# EAGLE design LoRaWAN_FW_RevB (EAGLE 7.2.0)
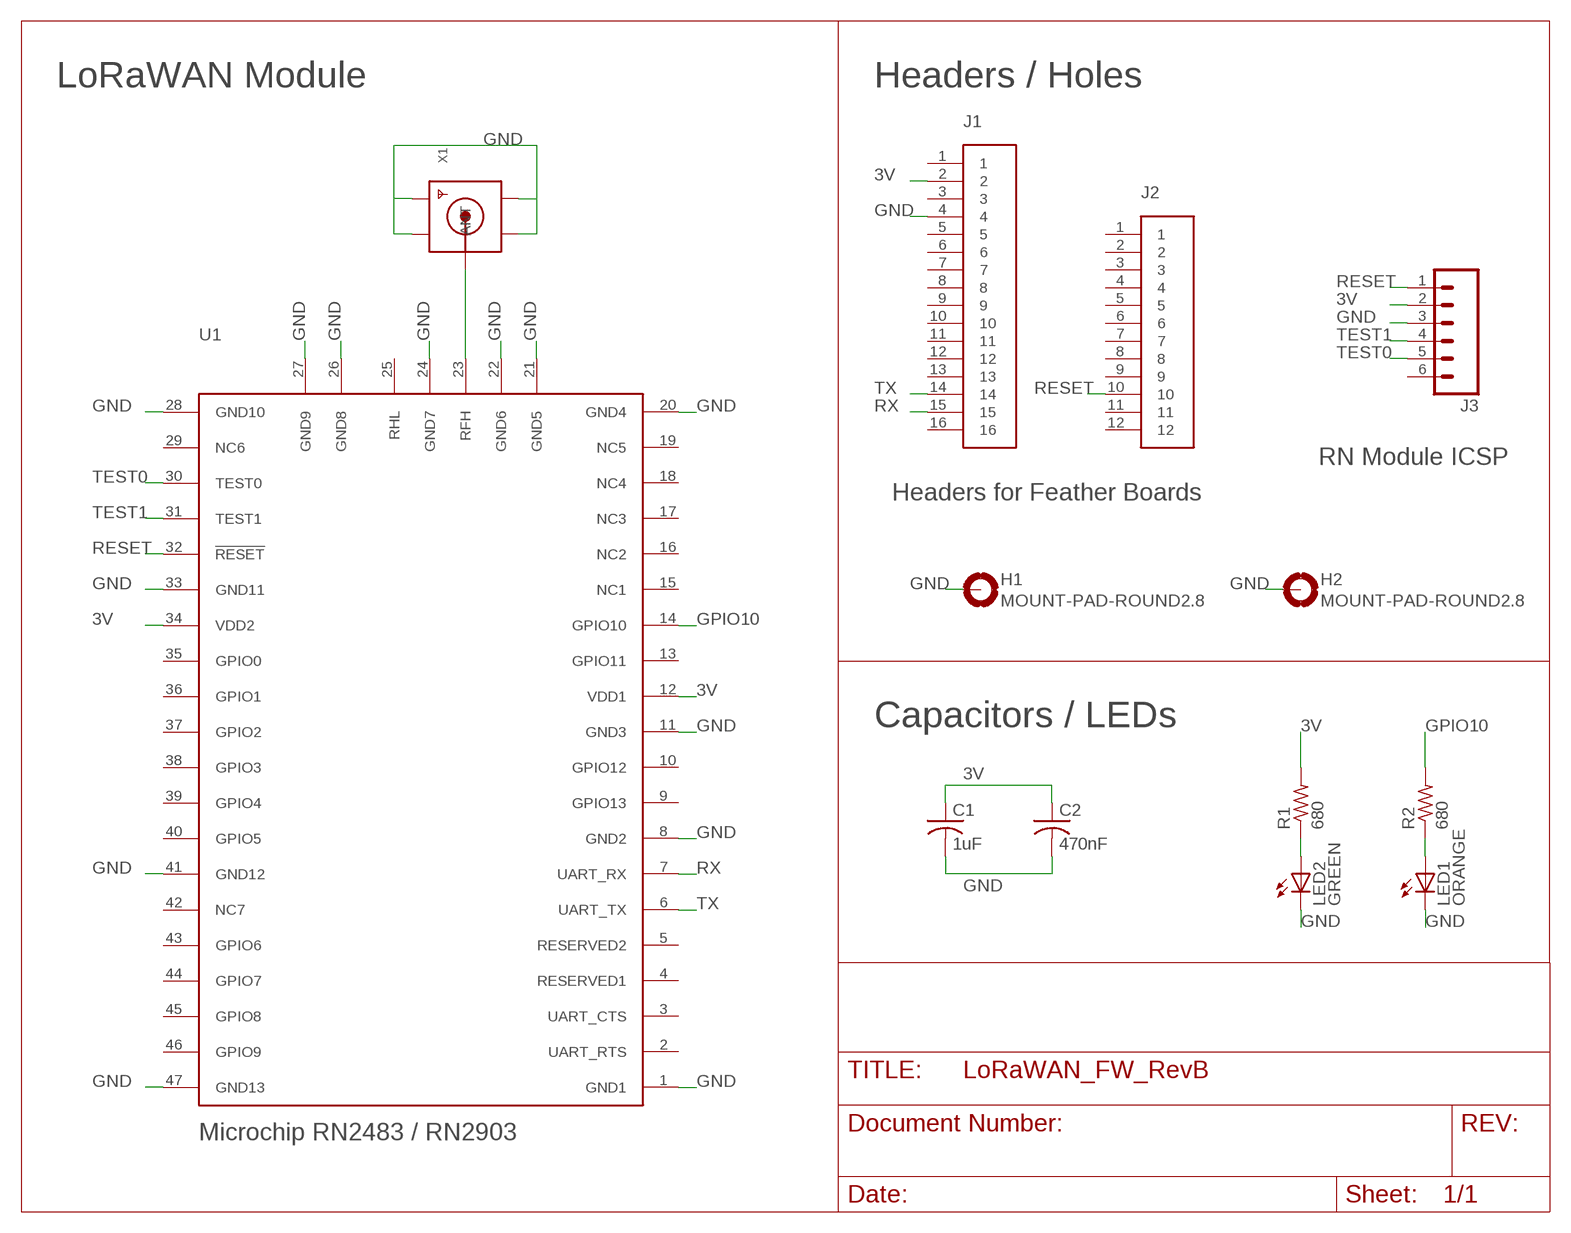
[diagram p0: schematic, sheet 1]

## Parts
C1  1uF  C-USC0603  [C0603]
C2  470nF  C-USC0603  [C0603]
H1  MOUNT-PAD-ROUND2.8  [2,8-PAD]
H2  MOUNT-PAD-ROUND2.8  [2,8-PAD]
J1  1X16_SMD_HEADER  [1X16_SMD_HEADER]
J2  1X12_SMD_HEADER  [1X12_SMD_HEADER]
J3  M06SILK_FEMALE_PTH  [1X06]
LED1  ORANGE  LEDCHIPLED_0805  [CHIPLED_0805]
LED2  GREEN  LEDCHIPLED_0805  [CHIPLED_0805]
R1  680  R-US_R0603  [R0603]
R2  680  R-US_R0603  [R0603]
U1  RN2483/RN2903  [RN2483/RN2903]
X1  SMACONNECTOR_EDGE  [SMA_EDGELAUNCH]

## Nets
3V: C1.1 C2.1 J1.2 J3.2 R1.2 U1.12(VDD1) U1.34(VDD2)
GND: C1.2 C2.2 H1.B2,8(MOUNT) H2.B2,8(MOUNT) J1.4 J3.3 LED1.C LED2.C U1.1(GND1) U1.8(GND2) U1.11(GND3) U1.20(GND4) U1.21(GND5) U1.22(GND6) U1.24(GND7) U1.26(GND8) U1.27(GND9) U1.28(GND10) U1.33(GND11) U1.41(GND12) U1.47(GND13) X1.GND@1(GND4) X1.GND@2(GND3) X1.GND@3(GND2) X1.GND@4(GND1)
GPIO10: R2.2 U1.14(GPIO10)
N$2: LED1.A R2.1
N$3: U1.23(RFH) X1.P(ANT)
N$9: LED2.A R1.1
RESET: J2.10 J3.1 U1.32(!RESET)
RX: J1.15 U1.7(UART_RX)
TEST0: J3.5 U1.30(TEST0)
TEST1: J3.4 U1.31(TEST1)
TX: J1.14 U1.6(UART_TX)
Unconnected: J1.1 J1.3 J1.5 J1.6 J1.7 J1.8 J1.9 J1.10 J1.11 J1.12 J1.13 J1.16 J2.1 J2.2 J2.3 J2.4 J2.5 J2.6 J2.7 J2.8 J2.9 J2.11 J2.12 J3.6 U1.2(UART_RTS) U1.3(UART_CTS) U1.4(RESERVED1) U1.5(RESERVED2) U1.9(GPIO13) U1.10(GPIO12) U1.13(GPIO11) U1.15(NC1) U1.16(NC2) U1.17(NC3) U1.18(NC4) U1.19(NC5) U1.25(RHL) U1.29(NC6) U1.35(GPIO0) U1.36(GPIO1) U1.37(GPIO2) U1.38(GPIO3) U1.39(GPIO4) U1.40(GPIO5) U1.42(NC7) U1.43(GPIO6) U1.44(GPIO7) U1.45(GPIO8) U1.46(GPIO9)

## Notes on the sheet
- LoRaWAN Module | Headers / Holes
- RN Module ICSP
- Headers for Feather Boards
- Capacitors / LEDs
- Microchip RN2483 / RN2903

## Library data of the parts
C1 C2 = adafruit:C-US: CAPACITOR, American symbol
H1 H2 = holes:MOUNT-PAD-ROUND: MOUNTING PAD, round
J1 = SyncChannelCustom:1X16_SMD_HEADER: 1x16 pin 0.1" Header SMD< Digikey Part Number: - Male: S5647-ND
J2 = SyncChannelCustom:1X12_SMD_HEADER: 1x12 pin 0.1" Header SMD Digikey Part Number: - Male: S5643-ND
J3 = SparkFun-ConnectorsNEW:M06: Header 6 Standard 6-pin 0.1" header. Use with straight break away headers (SKU : PRT-00116), right angle break away headers (PRT-00553), swiss pins (PRT-00743), machine pins (PRT-00117), and female headers (PRT-00115). Molex polarized connector foot print use with SKU : PRT-08094 with associated crimp pins and housings. NOTES ON THE VARIANTS LOCK and LOCK_LONGPADS... This footprint was designed to help hold the alignment of a through-hole component (i.e. 6-pin header) while soldering it into place. You may notice that each hole has been shifted either up or down by 0.005 of an inch from it's more standard position (which is a perfectly straight line). This slight alteration caused the pins (the squares in the middle) to touch the edges of the holes. Because they are alternating, it causes a "brace" to hold the component in place. 0.005 has proven to be the perfect amount of "off-center" position when using our standard breakaway headers. Although looks a little odd when you look at the bare footprint, once you have a header in there, the alteration is very hard to notice. Also,if you push a header all the way into place, it is covered up entirely on the bottom side. This idea of altering the position of holes to aid alignment will be further integrated into the Sparkfun Library for other footprints. It can help hold any component with 3 or more connection pins.; PROD_ID: CONN-08437
LED1 LED2 = adafruit:LED: LED OSRAM: - CHIPLED LG R971, LG N971, LY N971, LG Q971, LY Q971, LO R971, LY R971 LH N974, LH R974 LS Q976, LO Q976, LY Q976 LO Q996 - Hyper CHIPLED LW Q18S LB Q993, LB Q99A, LB R99A - SideLED LS A670, LO A670, LY A670, LG A670, LP A670 LB A673, LV A673, LT A673, LW A673 LH A674 LY A675 LS A676, LA A676, LO A676, LY A676, LW A676 LS A679, LY A679, LG A679 - Hyper Micro SIDELED® LS Y876, LA Y876, LO Y876, LY Y876 LT Y87S - SmartLED LW L88C, LW L88S LB L89C, LB L89S, LG L890 LS L89K, LO L89K, LY L89K LS L896, LA L896, LO L896, LY L896 - TOPLED LS T670, LO T670, LY T670, LG T670, LP T670 LSG T670, LSP T670, LSY T670, LOP T670, LYG T670 LG T671, LOG T671, LSG T671 LB T673, LV T673, LT T673, LW T673 LH T674 LS T676, LA T676, LO T676, LY T676, LB T676, LH T676, LSB T676, LW T676 LB T67C, LV T67C, LT T67C, LS T67K, LO T67K, LY T67K, LW E67C LS E67B, LA E67B, LO E67B, LY E67B, LB E67C, LV E67C, LT E67C LW T67C LS T679, LY T679, LG T679 LS T770, LO T770, LY T770, LG T770, LP T770 LB T773, LV T773, LT T773, LW T773 LH T774 LS E675, LA E675, LY E675, LS T675 LS T776, LA T776, LO T776, LY T776, LB T776 LHGB T686 LT T68C, LB T68C - Hyper Mini TOPLED® LB M676 - Mini TOPLED Santana® LG M470 LS M47K, LO M47K, LY M47K Source: http://www.osram.convergy.de/
R1 R2 = adafruit2:R-US_: RESISTOR, American symbol
U1 = SyncChannelCustom:RN2483/RN2903: MicroChip RN2483/RN2903 LoRaWAN Module Digikey Part Numbers: - RN2903-I/RM095-ND - RN2483-I/RM101-ND
X1 = adafruit:SMACONNECTOR: SMA Connector 90° DIP SMA Connector, 50 Ohm (4UConnector: 07259)

## Net classes
1 power: width 0.305 mm

## Board
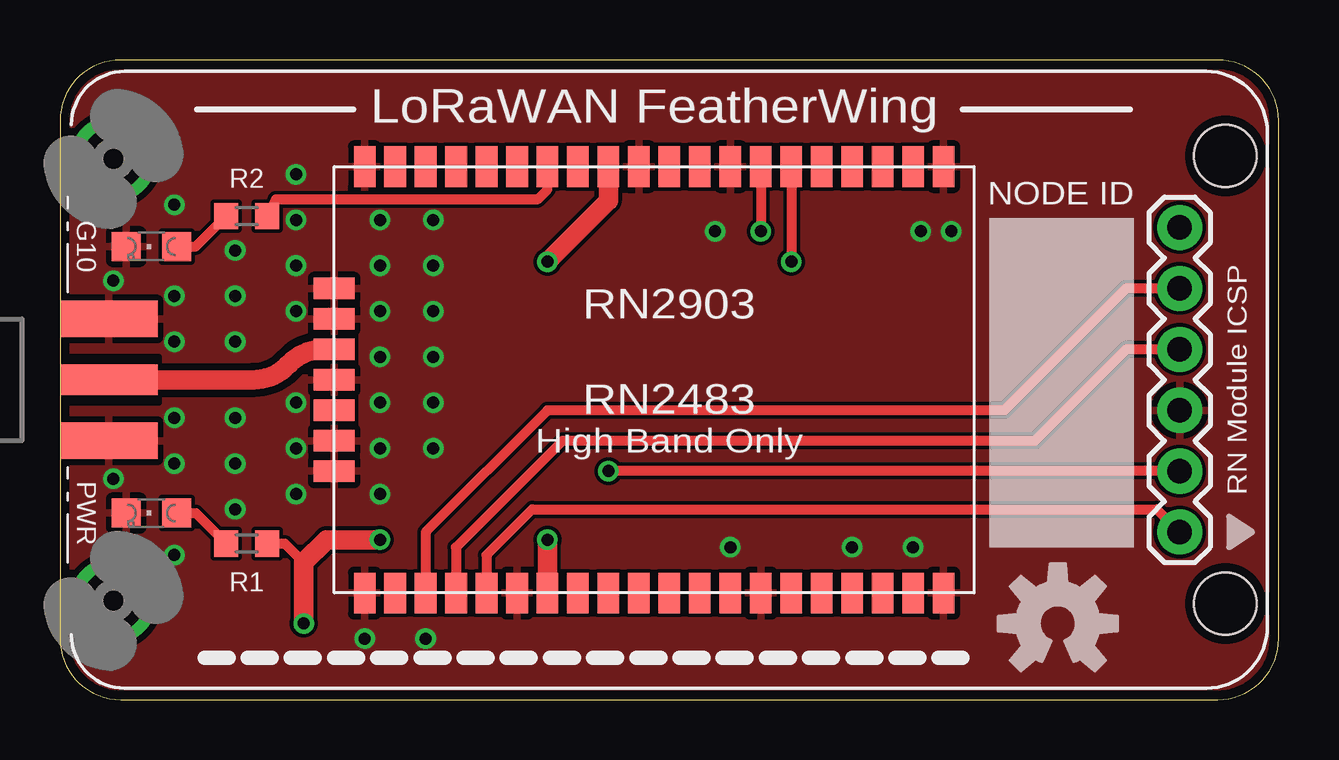
[diagram p1: board, top side]
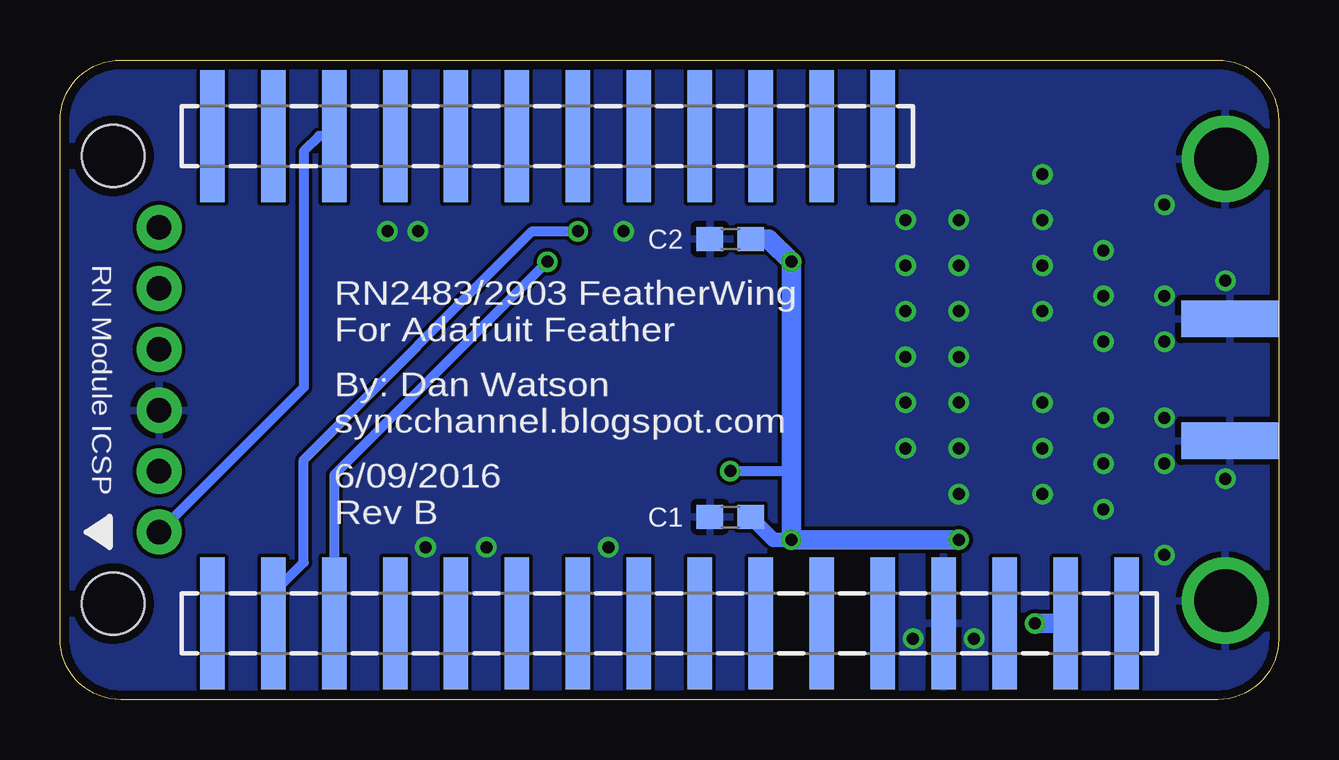
[diagram p2: board, bottom side, seen from below]

Size 50.8 x 26.67 mm. Coordinates in mm from the lower left corner, seen from the top.
Outline: 2.54,0 48.26,0 arc90 50.8,2.54 50.8,24.13 arc90 48.26,26.67 2.54,26.67 arc90 0,24.13 0,2.54 arc90 2.54,0
Copper layers (1*16): Top 0.0356mm / dielectric 1.5011mm / Bottom 0.0356mm
Design rules "oshpark-2layer *": minimum track width 6mil, minimum drill 13mil, track to track 6mil, track to pad 6mil, pad to pad 6mil, via to via 6mil, smd to smd 6mil, copper to edge 15mil, drill to drill 6mil, minimum pad ring 7mil, minimum via ring 7mil, stop-mask expansion 4mil, vias tented up to drill 20mil, thermal gap 10mil
Holes 2.6 mm at 48.58,22.67 48.58,4
tRestrict: area 0.6,12.4 to 4.1,14.3; 4 lines

### Footprints (pad centres in the part's own frame; a part is rotated, then mirrored left to right if it is on the bottom)
C0603 = smd 1.1 x 1: 1 -0.85,0; 2 0.85,0
2,8-PAD = drill 2.6 pad 3.6: B2,8 0,0
1X16_SMD_HEADER = smd 1.02 x 5.5: 1 1.27,0; 2 3.81,0; 3 6.35,0; 4 8.89,0; 5 11.43,0; 6 13.97,0; 7 16.51,0; 8 19.05,0; 9 21.59,0; 10 24.13,0; 11 26.67,0; 12 29.21,0; 13 31.75,0; 14 34.29,0; 15 36.83,0; 16 39.37,0
1X12_SMD_HEADER = smd 1.02 x 5.5: 1 1.27,0; 2 3.81,0; 3 6.35,0; 4 8.89,0; 5 11.43,0; 6 13.97,0; 7 16.51,0; 8 19.05,0; 9 21.59,0; 10 24.13,0; 11 26.67,0; 12 29.21,0
1X06 = drill 1.016 pad 1.88: 1 0,0; 2 2.54,0; 3 5.08,0; 4 7.62,0; 5 10.16,0; 6 12.7,0
CHIPLED_0805 = smd 1.2 x 1.2: A 0,-1.05; C 0,1.05
R0603 = smd 1 x 1.1: 1 -0.85,0; 2 0.85,0
RN2483/RN2903 = smd 1.7 x 0.9: 1 17.78,1.27; 2 17.78,2.54; 3 17.78,3.81; 4 17.78,5.08; 5 17.78,6.35; 6 17.78,7.62; 7 17.78,8.89; 8 17.78,10.16; 9 17.78,11.43; 10 17.78,12.7; 11 17.78,13.97; 12 17.78,15.24; 13 17.78,16.51; 14 17.78,17.78; 15 17.78,19.05; 16 17.78,20.32; 17 17.78,21.59; 18 17.78,22.86; 19 17.78,24.13; 20 17.78,25.4; 28 0,25.4; 29 0,24.13; 30 0,22.86; 31 0,21.59; 32 0,20.32; 33 0,19.05; 34 0,17.78; 35 0,16.51; 36 0,15.24; 37 0,13.97; 38 0,12.7; 39 0,11.43; 40 0,10.16; 41 0,8.89; 42 0,7.62; 43 0,6.35; 44 0,5.08; 45 0,3.81; 46 0,2.54; 47 0,1.27 | smd 0.9 x 1.7: 21 12.7,26.67; 22 11.43,26.67; 23 10.16,26.67; 24 8.89,26.67; 25 7.62,26.67; 26 6.35,26.67; 27 5.08,26.67
SMA_EDGELAUNCH = smd 4.064 x 1.524: GND@1 2.032,-2.54; GND@2 2.032,2.54 | smd 4.064 x 1.524 bottom: GND@3 2.032,2.54; GND@4 2.032,-2.54 | smd 4.064 x 1.27: P 2.032,0

### Placement (x,y rotation side)
C1  22.86,19.21 180 bottom
C2  22.86,7.62 180 bottom
H1  2.22,22.54 0 top
H2  2.22,4.13 0 top
J1  5.08,3.17 180 bottom
J2  15.24,23.5 180 bottom
J3  46.67,6.99 90 top
LED1  3.81,18.89 90 top
LED2  3.81,7.78 90 top
R1  7.78,6.51 0 top
R2  7.78,20.16 0 top
U1  38.1,4.45 90 top
U$1  [OSHW-LOGO-M]  41.59,3.17 0 top
X1  0,13.33 0 top

### Tracks (layer width: path | path; a pad name or v marks a point on that pad's centre or on a via)
3V  (via drill 0.5)
  Top 0.406: J3.2 v22.86,9.53 | R1.2 9.37,6.51 10.16,5.71
  Top 0.813: U1.34 v20.32,6.67 | v13.34,6.67 11.11,6.67 10.16,5.71 v10.16,3.17 | U1.12 22.86,20.8 v20.32,18.26
  Bottom 0.406: v22.86,9.53 20.32,9.53
  Bottom 0.61: v20.32,6.67 21.06,6.67 C2.1
  Bottom 0.813: v13.34,6.67 v20.32,6.67 20.32,9.53 v20.32,18.26 21.27,19.21 C1.1 | J1.2 v10.16,3.17
GND  (via drill 0.5)
  other vias: 4.76,14.92 7.3,14.92 7.3,16.83 4.76,16.83 9.84,16.19 9.84,12.38 7.3,11.75 7.3,9.84 4.76,11.75 4.76,9.84 9.84,10.48 2.22,17.46 2.22,9.21 4.76,6.03 13.34,18.1 13.34,16.19 13.34,12.38 13.34,10.48 15.56,18.1 15.56,16.19 15.56,12.38 15.56,10.48 13.34,8.57 15.56,20 13.34,20 9.84,18.1 9.84,20 7.3,18.73 9.84,21.91 4.76,20.64 7.3,7.94 9.84,8.57 13.34,14.29 15.56,14.29 37.15,19.53 35.88,19.53 35.56,6.35 33.02,6.35 27.3,19.53 27.94,6.35 12.7,2.54 15.24,2.54
  pour Top: -6.35,28.58 -6.35,-1.91 54.61,-1.91 54.61,28.58
  pour Bottom: -7.62,29.85 -7.62,-3.17 55.88,-3.17 55.88,31.12 -7.62,31.12
GPIO10
  Top 0.406: U1.14 20.32,21.27 19.9,20.85 9,20.85 R2.2
N$2
  Top 0.406: LED1.A 5.66,18.89 R2.1
N$3
  Top 0.813: U1.23 10.99,14.6 arc45 9.57,14.02 9.48,13.92 arc-45 8.06,13.33 X1.P
N$9
  Top 0.406: LED2.A 5.66,7.78 R1.1
RESET
  Top 0.406: U1.32 17.78,6.03 19.68,7.94 45.72,7.94 J3.1
  Bottom 0.406: J2.10 40.01,23.5 40.64,22.86 40.64,13.02 J3.1
RX  (via drill 0.5)
  Top 0.406: U1.7 v29.21,19.53
  Bottom 0.406: v29.21,19.53 31.11,19.53 40.64,10 40.64,5.71 41.91,4.45 J1.15
TEST0
  Top 0.406: J3.5 44.45,17.14 39.37,12.06 20.32,12.06 15.24,6.99 U1.30
TEST1
  Top 0.406: J3.4 44.45,14.6 40.64,10.79 20.95,10.79 16.51,6.35 U1.31
TX  (via drill 0.5)
  Top 0.406: U1.6 v30.48,18.26
  Bottom 0.406: v30.48,18.26 39.37,9.37 J1.14

### Text on the board
tNames: LoRaWAN FeatherWing | R2 | NODE ID | G10 | RN2903 | RN2483 | RN Module ICSP | High Band Only | PWR | R1
bNames: C2 | RN2483/2903 FeatherWing / For Adafruit Feather | RN Module ICSP | By: Dan Watson / syncchannel.blogspot.com | 6/09/2016 / Rev B | C1